# Altium project Controller.PrjPCB
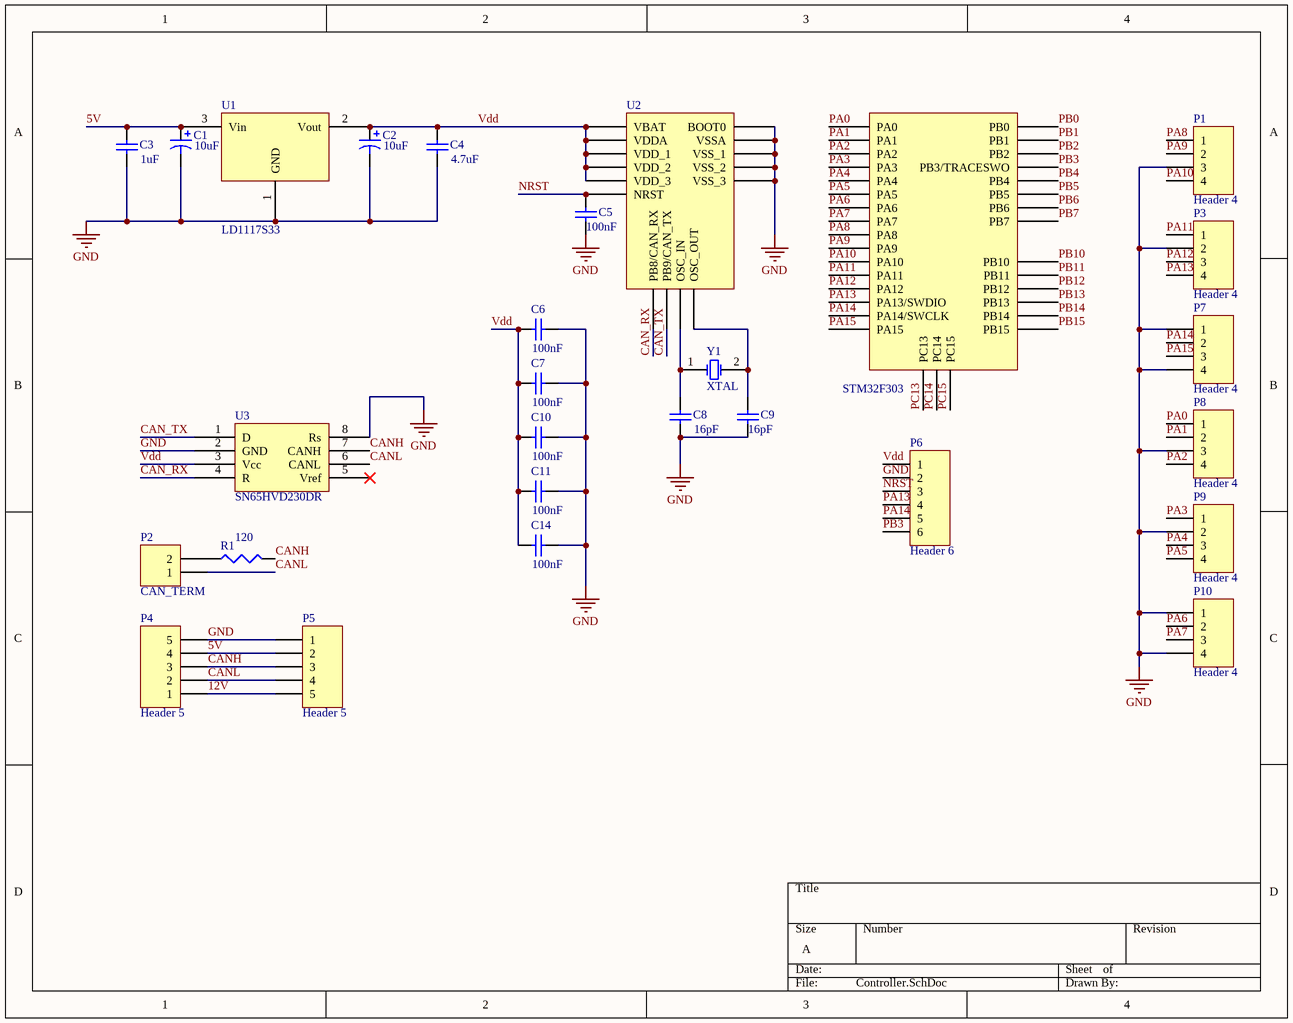
[diagram p0: Controller.SchDoc]
1 sheet, 27 parts. Net scope: global (net labels, ports and power ports of the same name join across sheets).
Board files: PCB1.PcbDoc, Controller.PcbDoc

## Sheet Controller.SchDoc
size A

### Parts
C1  value 10uF  [CAPM6032X28N]  (hidden comment: Cap Pol3)
C2  value 10uF  [CAPM6032X28N]  (hidden comment: Cap Pol3)
C3  value 1uF  [1608[0603]]  (hidden comment: Cap Semi)
C4  value 4.7uF  [1608[0603]]  (hidden comment: Cap Semi)
C5  value 100nF  [1608[0603]]  (hidden comment: Cap Semi)
C6  value 100nF  [1608[0603]]  (hidden comment: Cap Semi)
C7  value 100nF  [1608[0603]]  (hidden comment: Cap Semi)
C8  value 16pF  [1608[0603]]  (hidden comment: Cap Semi)
C9  value 16pF  [1608[0603]]  (hidden comment: Cap Semi)
C10  value 100nF  [1608[0603]]  (hidden comment: Cap Semi)
C11  value 100nF  [1608[0603]]  (hidden comment: Cap Semi)
C14  value 100nF  [1608[0603]]  (hidden comment: Cap Semi)
P1  Header 4  [PH_CONN_4]
P2  CAN_TERM  [HDR1X2]
P3  Header 4  [PH_CONN_4]
P4  Header 5  [CONN_5]
P5  Header 5  [CONN_5]
P6  Header 6  [HDR2X3]
P7  Header 4  [PH_CONN_4]
P8  Header 4  [PH_CONN_4]
P9  Header 4  [PH_CONN_4]
P10  Header 4  [PH_CONN_4]
R1  value 120  [RESC5025X07N]  (hidden comment: Res3)
U1  LD1117S33  [SOT230P700X180-4N]
U2  STM32F303  [TSQFP50P900X900X160-48N]
U3  SN65HVD230DR  [SOIC127P600X175-8N]
Y1  XTAL  [HC49/US]

### Nets
GND: C1.2 C2.2 C3.1 C4.1 C5.2 C6.1 C7.1 C8.1 C9.1 C10.1 C11.1 C14.1 P1.3 P3.2 P4.5 P5.1 P6.2 P7.1 P7.4 P8.3 P9.2 P10.1 P10.4 U1.1(GND) U2.8(VSSA) U2.23(VSS_2) U2.35(VSS_3) U2.44(BOOT0) U2.47(VSS_1) U3.2(GND) U3.8(Rs)
5V: C1.1 C3.2 P4.4 P5.2 U1.3(Vin)
12V: P4.1 P5.5
CAN_RX: U2.45(PB8/CAN_RX) U3.4(R)
CAN_TX: U2.46(PB9/CAN_TX) U3.1(D)
CANH: P4.3 P5.3 R1.2 U3.7(CANH)
CANL: P2.1 P4.2 P5.4 U3.6(CANL)
NRST: C5.1 P6.3 U2.7(NRST)
PA0: P8.1 U2.10(PA0)
PA1: P8.2 U2.11(PA1)
PA2: P8.4 U2.12(PA2)
PA3: P9.1 U2.13(PA3)
PA4: P9.3 U2.14(PA4)
PA5: P9.4 U2.15(PA5)
PA6: P10.2 U2.16(PA6)
PA7: P10.3 U2.17(PA7)
PA8: P1.1 U2.29(PA8)
PA9: P1.2 U2.30(PA9)
PA10: P1.4 U2.31(PA10)
PA11: P3.1 U2.32(PA11)
PA12: P3.3 U2.33(PA12)
PA13: P3.4 P6.4 U2.34(PA13/SWDIO)
PA14: P6.5 P7.2 U2.37(PA14/SWCLK)
PA15: P7.3 U2.38(PA15)
PB0: U2.18(PB0)
PB1: U2.19(PB1)
PB2: U2.20(PB2)
PB3: P6.6 U2.39(PB3/TRACESWO)
PB4: U2.40(PB4)
PB5: U2.41(PB5)
PB6: U2.42(PB6)
PB7: U2.43(PB7)
PB10: U2.21(PB10)
PB11: U2.22(PB11)
PB12: U2.25(PB12)
PB13: U2.26(PB13)
PB14: U2.27(PB14)
PB15: U2.28(PB15)
PC13: U2.2(PC13)
PC14: U2.3(PC14)
PC15: U2.4(PC15)
Vdd: C2.1 C4.2 C6.2 C7.2 C10.2 C11.2 C14.2 P6.1 U1.2(Vout) U2.1(VBAT) U2.9(VDDA) U2.24(VDD_2) U2.36(VDD_3) U2.48(VDD_1) U3.3(Vcc)
NetC8_2: C8.2 U2.5(OSC_IN) Y1.1(OSC1)
NetC9_2: C9.2 U2.6(OSC_OUT) Y1.2(OSC2)
NetP2_2: P2.2 R1.1

Not connected (* = marked no-connect by the designer): U3 5(Vref)*

### Library data of the parts
C1 C2 = Cap Pol3: Polarized Capacitor (Surface Mount); Published: 8-Jun-2000; LatestRevisionDate: 29-May-2009; LatestRevisionNote: IPC-7351 Footprint Added.; PackageReference: C0805; Publisher: Altium Limited; PackageDescription: Chip Capacitor
C3-C11 C14 = Cap Semi: Capacitor (Semiconductor SIM Model); Published: 8-Jun-2000; LatestRevisionDate: 29-May-2009; LatestRevisionNote: IPC-7351 Footprint Added.; PackageReference: C1206; Publisher: Altium Limited; PackageDescription: Chip Capacitor
P1 P3 P7-P10 = Header 4: Header, 4-Pin; LatestRevisionDate: 17-Jul-2002; LatestRevisionNote: Re-released for DXP Platform.; Publisher: Altium Limited
P2 = Header 2: Header, 2-Pin; LatestRevisionDate: 17-Jul-2002; LatestRevisionNote: Re-released for DXP Platform.; Publisher: Altium Limited
P4 P5 = Header 5: Header, 5-Pin; LatestRevisionDate: 17-Jul-2002; LatestRevisionNote: Re-released for DXP Platform.; Publisher: Altium Limited
P6 = Header 6: Header, 6-Pin; LatestRevisionDate: 17-Jul-2002; LatestRevisionNote: Re-released for DXP Platform.; Publisher: Altium Limited
R1 = Res3: Resistor; Published: 8-Jun-2000; LatestRevisionDate: 29-May-2009; LatestRevisionNote: IPC-7351 Footprint Added.; PackageReference: J1-0603; Publisher: Altium Limited; PackageDescription: Chip Resistor
Y1 = XTAL: Crystal Oscillator; Published: 8-Jun-2000; LatestRevisionDate: 17-Jul-2002; LatestRevisionNote: Re-released for DXP Platform.; PackageReference: R38; Publisher: Altium Limited; PackageDescription: Crystal, Thru-Hole; 2 Leads; Body 3.1 x 8.2 mm (Dia.xH)